# EAGLE design Analog Drum (EAGLE 9.2.2)
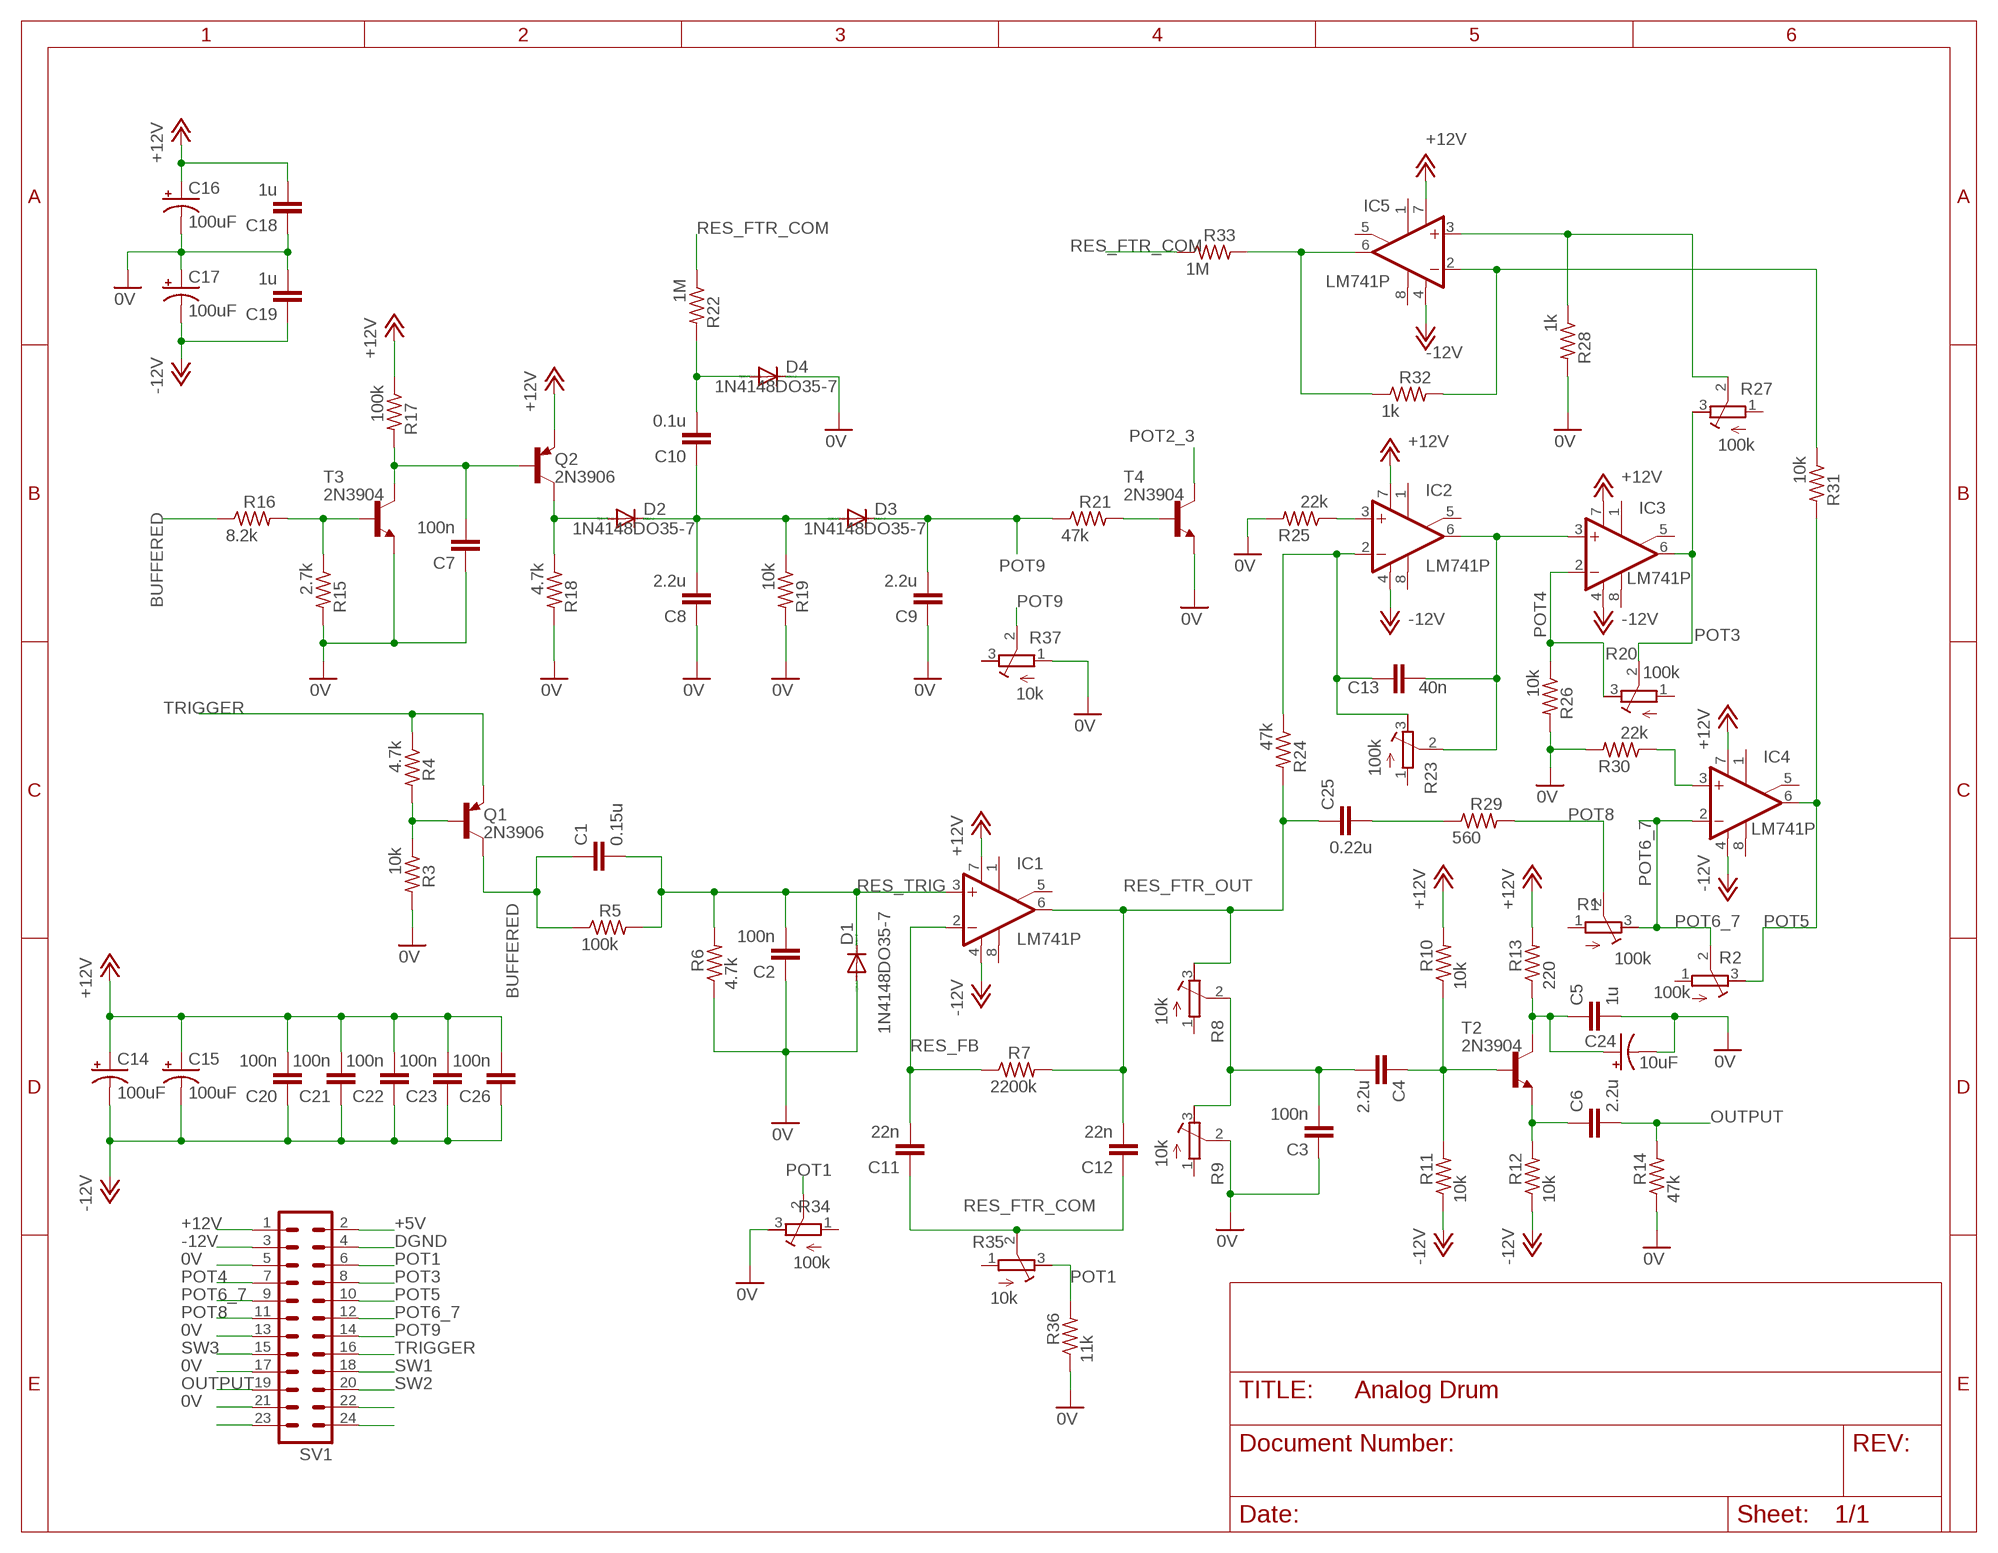
[diagram p0: schematic, sheet 1]

## Parts
C1  0.15u  C-EU050-024X044  [C050-024X044]
C2  100n  C-EU050-024X044  [C050-024X044]
C3  100n  C-EU050-024X044  [C050-024X044]
C4  2.2u  C-EU050-024X044  [C050-024X044]
C5  1u  C-EU050-024X044  [C050-024X044]
C6  2.2u  C-EU050-024X044  [C050-024X044]
C7  100n  C-EU050-024X044  [C050-024X044]
C8  2.2u  C-EU050-024X044  [C050-024X044]
C9  2.2u  C-EU050-024X044  [C050-024X044]
C10  0.1u  C-EU050-024X044  [C050-024X044]
C11  22n  C-EU050-024X044  [C050-024X044]
C12  22n  C-EU050-024X044  [C050-024X044]
C13  40n  C-EU050-024X044  [C050-024X044]
C14  100uF  CPOL-USE5-8.5  [E5-8,5]
C15  100uF  CPOL-USE5-8.5  [E5-8,5]
C16  100uF  CPOL-USE5-8.5  [E5-8,5]
C17  100uF  CPOL-USE5-8.5  [E5-8,5]
C18  1u  C-EU050-024X044  [C050-024X044]
C19  1u  C-EU050-024X044  [C050-024X044]
C20  100n  C-EU050-024X044  [C050-024X044]
C21  100n  C-EU050-024X044  [C050-024X044]
C22  100n  C-EU050-024X044  [C050-024X044]
C23  100n  C-EU050-024X044  [C050-024X044]
C24  10uF  CPOL-USE2.5-6  [E2,5-6]
C25  0.22u  C-EU050-024X044  [C050-024X044]
C26  100n  C-EU050-024X044  [C050-024X044]
D1  1N4148DO35-7  [DO35-7]
D2  1N4148DO35-7  [DO35-7]
D3  1N4148DO35-7  [DO35-7]
D4  1N4148DO35-7  [DO35-7]
IC1  LM741P  [DIL08]
IC2  LM741P  [DIL08]
IC3  LM741P  [DIL08]
IC4  LM741P  [DIL08]
IC5  LM741P  [DIL08]
Q1  2N3906  [TO92]
Q2  2N3906  [TO92]
R1  100k  R-TRIMM64W  [RTRIM64W]
R2  100k  R-TRIMM64W  [RTRIM64W]
R3  10k  R-US_0207/10  [0207/10]
R4  4.7k  R-US_0207/10  [0207/10]
R5  100k  R-US_0207/10  [0207/10]
R6  4.7k  R-US_0207/10  [0207/10]
R7  2200k  R-US_0207/10  [0207/10]
R8  10k  R-TRIMM64W  [RTRIM64W]
R9  10k  R-TRIMM64W  [RTRIM64W]
R10  10k  R-US_0207/10  [0207/10]
R11  10k  R-US_0207/10  [0207/10]
R12  10k  R-US_0207/10  [0207/10]
R13  220  R-US_0207/10  [0207/10]
R14  47k  R-US_0207/10  [0207/10]
R15  2.7k  R-US_0207/10  [0207/10]
R16  8.2k  R-US_0207/10  [0207/10]
R17  100k  R-US_0207/10  [0207/10]
R18  4.7k  R-US_0207/10  [0207/10]
R19  10k  R-US_0207/10  [0207/10]
R20  100k  R-TRIMM64W  [RTRIM64W]
R21  47k  R-US_0207/10  [0207/10]
R22  1M  R-US_0207/10  [0207/10]
R23  100k  R-TRIMM64W  [RTRIM64W]
R24  47k  R-US_0207/10  [0207/10]
R25  22k  R-US_0207/10  [0207/10]
R26  10k  R-US_0207/10  [0207/10]
R27  100k  R-TRIMM64W  [RTRIM64W]
R28  1k  R-US_0207/10  [0207/10]
R29  560  R-US_0207/10  [0207/10]
R30  22k  R-US_0207/10  [0207/10]
R31  10k  R-US_0207/10  [0207/10]
R32  1k  R-US_0207/10  [0207/10]
R33  1M  R-US_0207/10  [0207/10]
R34  100k  R-TRIMM64W  [RTRIM64W]
R35  10k  R-TRIMM64W  [RTRIM64W]
R36  11k  R-US_0207/10  [0207/10]
R37  10k  R-TRIMM64W  [RTRIM64W]
SV1  MA12-2  [MA12-2]
T2  2N3904  [TO92]
T3  2N3904  [TO92]
T4  2N3904  [TO92]

## Nets
0V: C2.1 C3.1 C5.2 C7.1 C8.1 C9.1 C24.- D1.A D4.C R3.2 R6.1 R9.2(S) R14.1 R15.2 R18.2 R19.2 R25.2 R26.2 R28.2 R30.2 R34.3(E) R36.1 R37.1(A) SV1.5 SV1.13 SV1.17 SV1.21 T3.3(E) T4.3(E)
+5V: SV1.2
+12V: C14.+ C15.+ C16.+ C18.2 C20.2 C21.2 C22.2 C23.2 C26.2 IC1.7(V+) IC2.7(V+) IC3.7(V+) IC4.7(V+) IC5.7(V+) Q2.3(E) R10.2 R13.2 R17.1 SV1.1
-12V: C14.- C15.- C17.- C19.1 C20.1 C21.1 C22.1 C23.1 C26.1 IC1.4(V-) IC2.4(V-) IC3.4(V-) IC4.4(V-) IC5.4(V-) R11.1 R12.1 SV1.3
BUFFERED: C1.1 Q1.1(C) R5.1 R16.1
DGND: SV1.4
N$1: C25.2 R29.1
N$2: IC4.3(+IN) R30.1
N$3: Q1.2(B) R3.1 R4.2
N$4: C10.2 D4.A R22.2
N$7: IC2.3(+IN) R25.1
N$8: C3.2 C4.2 R8.2(S) R9.3(E)
N$9: C4.1 R10.1 R11.2 T2.2(B)
N$10: C6.1 R12.2 T2.3(E)
N$11: C5.1 C24.+ R13.1 T2.1(C)
N$12: C13.2 IC2.2(-IN) R23.3(E) R24.1
N$13: R15.1 R16.2 T3.2(B)
N$14: C7.2 Q2.2(B) R17.2 T3.1(C)
N$15: D2.A Q2.1(C) R18.1
N$16: C8.2 C10.1 D2.C D3.A R19.1
N$18: R21.2 T4.2(B)
N$19: C13.1 IC2.6(OUT) IC3.3(+IN) R23.2(S)
N$22: IC5.3(+IN) R27.2(S) R28.1
N$24: SV1.23
N$25: SV1.24
N$26: SV1.22
N$29: IC5.2(-IN) R31.1 R32.2
N$30: C16.- C17.+ C18.1 C19.2 ; supply symbol labelled 0V
N$31: IC5.6(OUT) R32.1 R33.2
OUTPUT: C6.2 R14.2 SV1.19
POT1: R34.2(S) R35.3(E) R36.2 SV1.6
POT2_3: T4.1(C)
POT3: IC3.6(OUT) R20.2(S) R27.3(E) SV1.8
POT4: IC3.2(-IN) R20.3(E) R26.1 SV1.7
POT5: IC4.6(OUT) R2.3(E) R31.2 SV1.10
POT6_7: IC4.2(-IN) R1.3(E) R2.2(S) SV1.9 SV1.12
POT8: R1.2(S) R29.2 SV1.11
POT9: C9.2 D3.C R21.1 R37.2(S) SV1.14
RES_FB: C11.2 IC1.2(-IN) R7.1
RES_FTR_COM: C11.1 C12.1 R22.1 R33.1 R35.2(S)
RES_FTR_OUT: C12.2 C25.1 IC1.6(OUT) R7.2 R8.3(E) R24.2
RES_TRIG: C1.2 C2.2 D1.C IC1.3(+IN) R5.2 R6.2
SW1: SV1.18
SW2: SV1.20
SW3: SV1.15
TRIGGER: Q1.3(E) R4.1 SV1.16
Unconnected: IC1.1(ON1) IC1.5(ON2) IC1.8(OPT) IC2.1(ON1) IC2.5(ON2) IC2.8(OPT) IC3.1(ON1) IC3.5(ON2) IC3.8(OPT) IC4.1(ON1) IC4.5(ON2) IC4.8(OPT) IC5.1(ON1) IC5.5(ON2) IC5.8(OPT) R1.1(A) R2.1(A) R8.1(A) R9.1(A) R20.1(A) R23.1(A) R27.1(A) R34.1(A) R35.1(A) R37.3(E)

## Library data of the parts
C1-C13 C18-C23 C25 C26 = resistor:C-EU: CAPACITOR, European symbol
C14-C17 C24 = rcl:CPOL-US: POLARIZED CAPACITOR, American symbol; SPICEPREFIX: C
D1-D4 = diode:1N4148: DIODE high speed (Philips)
IC1-IC5 = linear:*741: OP AMP
Q1 Q2 = transistor-pnp:2N3906: PNP Transistor
R1 R2 R8 R9 R20 R23 R27 R34 R35 R37 = rcl:R-TRIMM: Trimm resistor; SPICEMODEL: X; SPICEPREFIXL: POT
R3-R7 R10-R19 R21 R22 R24-R26 R28-R33 R36 = resistor:R-US_: RESISTOR, American symbol
SV1 = con-lstb:MA12-2: PIN HEADER; OC_FARNELL: unknown; OC_NEWARK: unknown
T2-T4 = transistor:2N3904: NPN TRANSISTOR

## Board
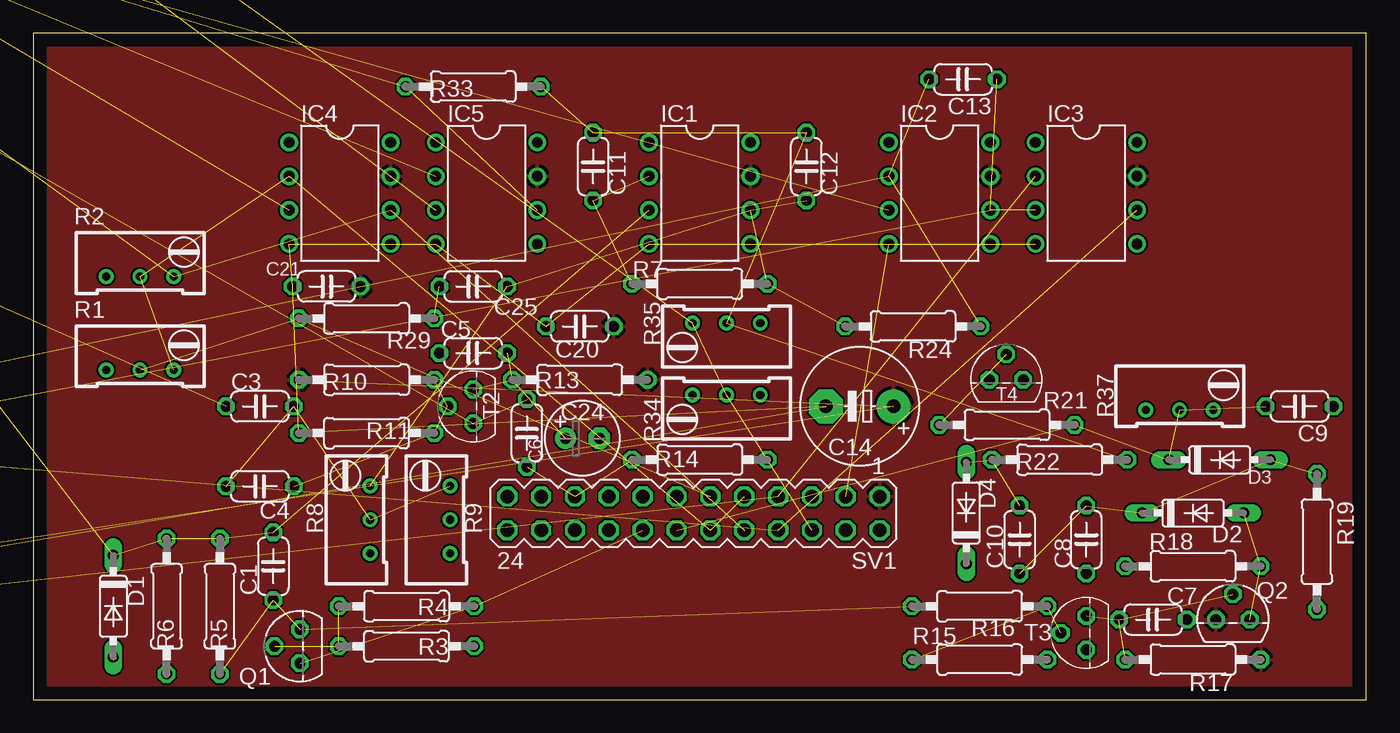
[diagram p1: board, top side]
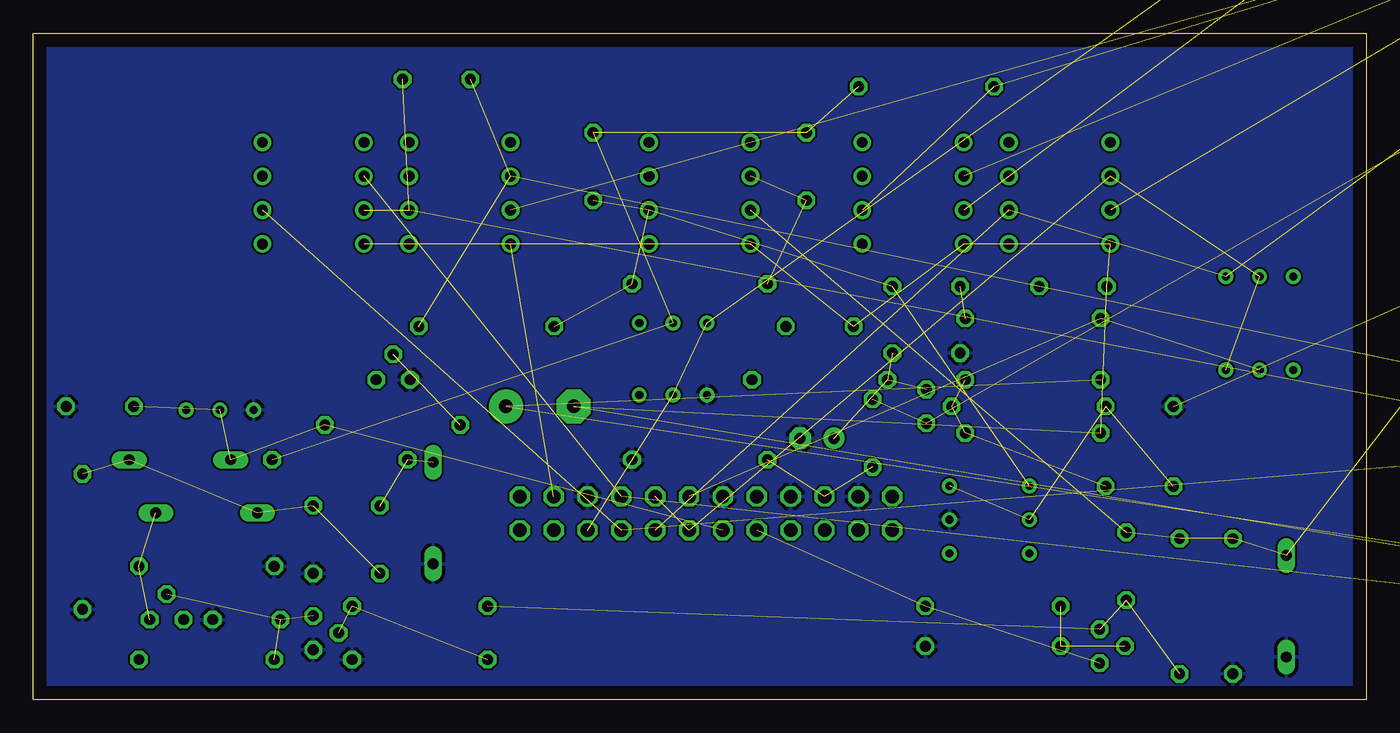
[diagram p2: board, bottom side, seen from below]

Size 100 x 50 mm. Coordinates in mm from the lower left corner, seen from the top.
Outline: 0,0 100,0 100,50 0,50 0,0
Copper layers (1*16): Top 0.035mm / dielectric 1.5mm / Bottom 0.035mm
Design rules "default": minimum track width 6mil, minimum drill 0.35mm, track to track 6mil, track to pad 6mil, pad to pad 6mil, via to via 6mil, smd to smd 6mil, copper to edge 40mil, drill to drill 6mil, minimum pad ring 10mil, minimum via ring 8mil, stop-mask expansion 4mil, vias tented up to drill 0mil, thermal gap 10mil

### Footprints (pad centres in the part's own frame; a part is rotated, then mirrored left to right if it is on the bottom)
C050-024X044 = drill 0.813 octagon: 1 -2.54,0; 2 2.54,0
E5-8,5 = drill 1.016 pad 2.54: + -2.54,0 | drill 1.016 pad 2.54 octagon: - 2.54,0
E2,5-6 = drill 0.813 pad 1.6: + -1.27,0 | drill 0.813 pad 1.6 octagon: - 1.27,0
DO35-7 = drill 0.813 long: A 3.81,0; C -3.81,0
DIL08 = drill 0.813 pad 1.27: 1 -3.81,-3.81; 2 -1.27,-3.81; 3 1.27,-3.81; 4 3.81,-3.81; 5 3.81,3.81; 6 1.27,3.81; 7 -1.27,3.81; 8 -3.81,3.81
TO92 = drill 0.813 octagon: 1 1.27,0; 2 0,1.905; 3 -1.27,0
RTRIM64W = drill 0.61: 1 1.27,-2.54; 2 1.27,0; 3 1.27,2.54
0207/10 = drill 0.813 octagon: 1 -5.08,0; 2 5.08,0
MA12-2 = drill 1.016 octagon: 1 -13.97,-1.27; 2 -13.97,1.27; 3 -11.43,-1.27; 4 -11.43,1.27; 5 -8.89,-1.27; 6 -8.89,1.27; 7 -6.35,-1.27; 8 -6.35,1.27; 9 -3.81,-1.27; 10 -3.81,1.27; 11 -1.27,-1.27; 12 -1.27,1.27; 13 1.27,-1.27; 14 1.27,1.27; 15 3.81,-1.27; 16 3.81,1.27; 17 6.35,-1.27; 18 6.35,1.27; 19 8.89,-1.27; 20 8.89,1.27; 21 11.43,-1.27; 22 11.43,1.27; 23 13.97,-1.27; 24 13.97,1.27

### Placement (x,y rotation side)
C1  18,10 90 top
C2  -16.51,36.83 0 top  (outside the outline)
C3  17,22 0 top
C4  17,16 180 top
C5  33,26 180 top
C6  37.03,19.99 270 top
C7  84,6 180 top
C8  79,12 90 top
C9  95,22 180 top
C10  74,12 90 top
C11  42,40 270 top
C12  58,40 270 top
C13  69.75,46.55 180 top
C14  62,22 180 top
C15  -35.56,6.35 0 top  (outside the outline)
C16  -49.53,6.35 0 top  (outside the outline)
C17  -63.5,6.35 0 top  (outside the outline)
C18  -39.37,44.45 0 top  (outside the outline)
C19  -46.99,44.45 0 top  (outside the outline)
C20  41,28 0 top
C21  22,31 0 top
C22  -69.85,44.45 0 top  (outside the outline)
C23  -77.47,44.45 0 top  (outside the outline)
C24  41.2,19.6 0 top
C25  33,31 180 top
C26  -80,19 0 top  (outside the outline)
D1  6,7 270 top
D2  87,14 0 top
D3  89,18 0 top
D4  70,14 90 top
IC1  50,38 270 top
IC2  68,38 270 top
IC3  79,38 270 top
IC4  23,38 270 top
IC5  34,38 270 top
Q1  20,4 90 top
Q2  90,6 0 top
R1  8,26 270 top
R2  8,33 270 top
R3  28,4 0 top
R4  28,7 180 top
R5  14,7 90 top
R6  10,7 90 top
R7  50,31.2 0 top
R8  24,13.5 0 top
R9  30,13.5 0 top
R10  25,24 180 top
R11  25,20 0 top
R12  -44.45,62.23 0 top  (outside the outline)
R13  41,24 0 top
R14  50,18 180 top
R15  71,3 0 top
R16  71,7 0 top
R17  87,3 180 top
R18  87,10 180 top
R19  96.31,11.85 270 top
R20  -76,-2 0 top  (outside the outline)
R21  73.05,20.61 180 top
R22  77,18 180 top
R23  -27.94,17.78 0 top  (outside the outline)
R24  66,28 180 top
R25  -57.15,72.39 0 top  (outside the outline)
R26  -35.85,33.39 0 top  (outside the outline)
R27  -38.1,17.78 0 top  (outside the outline)
R28  -19.05,77.47 0 top  (outside the outline)
R29  25,28.6 180 top
R30  -44.45,77.47 0 top  (outside the outline)
R31  -57.15,77.47 0 top  (outside the outline)
R32  -69.85,77.47 0 top  (outside the outline)
R33  33,46 180 top
R34  52,21.6 90 top
R35  52,27 90 top
R36  -31.75,82.55 0 top  (outside the outline)
R37  86,23 270 top
SV1  49.53,13.97 180 top
T2  33,22 90 top
T3  79,5 90 top
T4  73,24 0 top

### Tracks (layer width: path | path; a pad name or v marks a point on that pad's centre or on a via)
0V  (6 unrouted)
  pour Bottom: -2,52 102,52 102,-2 -2,-2
+12V  (7 unrouted)
  pour Top: -1,51 -1,-1 101,-1 101,51
-12V  (16 unrouted)
BUFFERED  (3 unrouted)
N$1  (1 unrouted)
N$2  (1 unrouted)
N$3  (2 unrouted)
N$4  (2 unrouted)
N$7  (1 unrouted)
N$8  (3 unrouted)
N$9  (3 unrouted)
N$10  (2 unrouted)
N$11  (3 unrouted)
N$12  (3 unrouted)
N$13  (2 unrouted)
N$14  (3 unrouted)
N$15  (2 unrouted)
N$16  (4 unrouted)
N$18  (1 unrouted)
N$19  (3 unrouted)
N$22  (2 unrouted)
N$29  (2 unrouted)
N$30  (3 unrouted)
N$31  (2 unrouted)
OUTPUT  (2 unrouted)
POT1  (3 unrouted)
POT3  (3 unrouted)
POT4  (3 unrouted)
POT5  (3 unrouted)
POT6_7  (4 unrouted)
POT8  (2 unrouted)
POT9  (4 unrouted)
RES_FB  (2 unrouted)
RES_FTR_COM  (4 unrouted)
RES_FTR_OUT  (5 unrouted)
RES_TRIG  (5 unrouted)
TRIGGER  (2 unrouted)